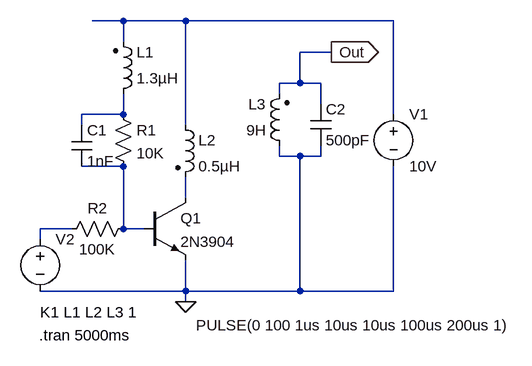
[diagram p0: schematic Test_oscillateur.asc]
Test_oscillateur.asc, the LTspice schematic file:
Version 4
SHEET 1 880 680
WIRE 80 16 32 16
WIRE 176 16 80 16
WIRE 496 16 176 16
WIRE 80 48 80 16
WIRE 400 64 352 64
WIRE 352 112 352 64
WIRE 352 112 320 112
WIRE 384 112 352 112
WIRE 320 128 320 112
WIRE 384 144 384 112
WIRE 80 160 80 128
WIRE 80 160 16 160
WIRE 496 160 496 16
WIRE 16 176 16 160
WIRE 176 176 176 16
WIRE 320 224 320 208
WIRE 352 224 320 224
WIRE 384 224 384 208
WIRE 384 224 352 224
WIRE 80 240 16 240
WIRE 176 288 176 256
WIRE 0 336 -48 336
WIRE 80 336 80 240
WIRE 112 336 80 336
WIRE -48 352 -48 336
WIRE 176 432 176 384
WIRE 176 432 -48 432
WIRE 352 432 352 224
WIRE 352 432 176 432
WIRE 496 432 496 240
WIRE 496 432 352 432
WIRE 176 448 176 432
FLAG 176 448 0
FLAG 400 64 Out
IOPIN 400 64 Out
SYMBOL ind2 64 144 M180
WINDOW 0 36 80 Left 2
WINDOW 3 36 40 Left 2
SYMATTR InstName L1
SYMATTR Value 1.3µH
SYMATTR Type ind
SYMBOL ind2 160 160 R0
SYMATTR InstName L2
SYMATTR Value 0.5µH
SYMATTR Type ind
SYMBOL ind2 336 224 R180
WINDOW 0 36 80 Left 2
WINDOW 3 36 40 Left 2
SYMATTR InstName L3
SYMATTR Value 9H
SYMATTR Type ind
SYMBOL npn 112 288 R0
SYMATTR InstName Q1
SYMATTR Value 2N3904
SYMBOL voltage 496 144 R0
WINDOW 123 0 0 Left 0
WINDOW 39 0 0 Left 0
SYMATTR InstName V1
SYMATTR Value 10V
SYMBOL res 64 144 R0
SYMATTR InstName R1
SYMATTR Value 10K
SYMBOL cap 0 176 R0
SYMATTR InstName C1
SYMATTR Value 1nF
SYMBOL cap 368 144 R0
SYMATTR InstName C2
SYMATTR Value 500pF
SYMBOL voltage -48 336 R0
WINDOW 3 240 148 Left 2
WINDOW 123 0 0 Left 0
WINDOW 39 0 0 Left 0
SYMATTR InstName V2
SYMATTR Value PULSE(0 100 1us 10us 10us 100us 200us 1)
SYMBOL res 96 320 R90
WINDOW 0 0 56 VBottom 2
WINDOW 3 32 56 VTop 2
SYMATTR InstName R2
SYMATTR Value 100K
TEXT -48 464 Left 2 !K1 L1 L2 L3 1
TEXT -50 500 Left 2 !.tran 5000ms

The netlist it stands for:
* Test_oscillateur.asc
L1 N002 N001 1.3µH
L2 N001 N004 0.5µH
L3 0 Out 9H
Q1 N004 N003 0 0 2N3904
V1 N001 0 10V
R1 N002 N003 10K
C1 N002 N003 1nF
C2 Out 0 500pF
V2 N005 0 PULSE(0 100 1us 10us 10us 100us 200us 1)
R2 N003 N005 100K
.model NPN NPN
.model PNP PNP
.lib standard.bjt
K1 L1 L2 L3 1
.tran 5000ms
.backanno
.end